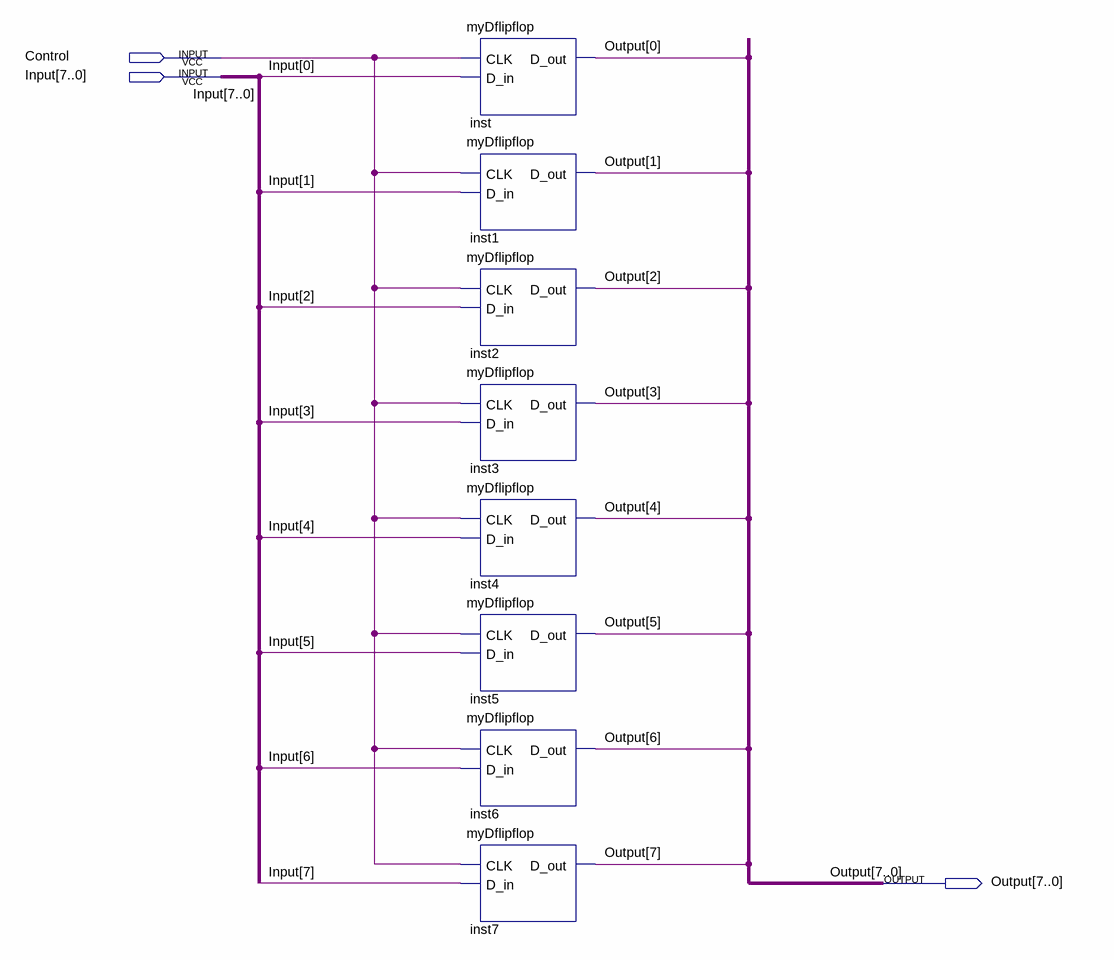
[diagram p0: schematic sheet]
// Quartus schematic my8bitregister.bdf as structural Verilog: 8 symbols, 3 pins
module my8bitregister (
  input  Control,
  input  [7:0] Input,
  output [7:0] Output
);

  myDflipflop inst (.CLK(Control), .D_in(Input[0]), .D_out(Output[0]));
  myDflipflop inst1 (.CLK(Control), .D_in(Input[1]), .D_out(Output[1]));
  myDflipflop inst2 (.CLK(Control), .D_in(Input[2]), .D_out(Output[2]));
  myDflipflop inst3 (.CLK(Control), .D_in(Input[3]), .D_out(Output[3]));
  myDflipflop inst4 (.CLK(Control), .D_in(Input[4]), .D_out(Output[4]));
  myDflipflop inst5 (.CLK(Control), .D_in(Input[5]), .D_out(Output[5]));
  myDflipflop inst6 (.CLK(Control), .D_in(Input[6]), .D_out(Output[6]));
  myDflipflop inst7 (.CLK(Control), .D_in(Input[7]), .D_out(Output[7]));
endmodule
